# EAGLE design l6219-dev-lut (EAGLE 5.12)
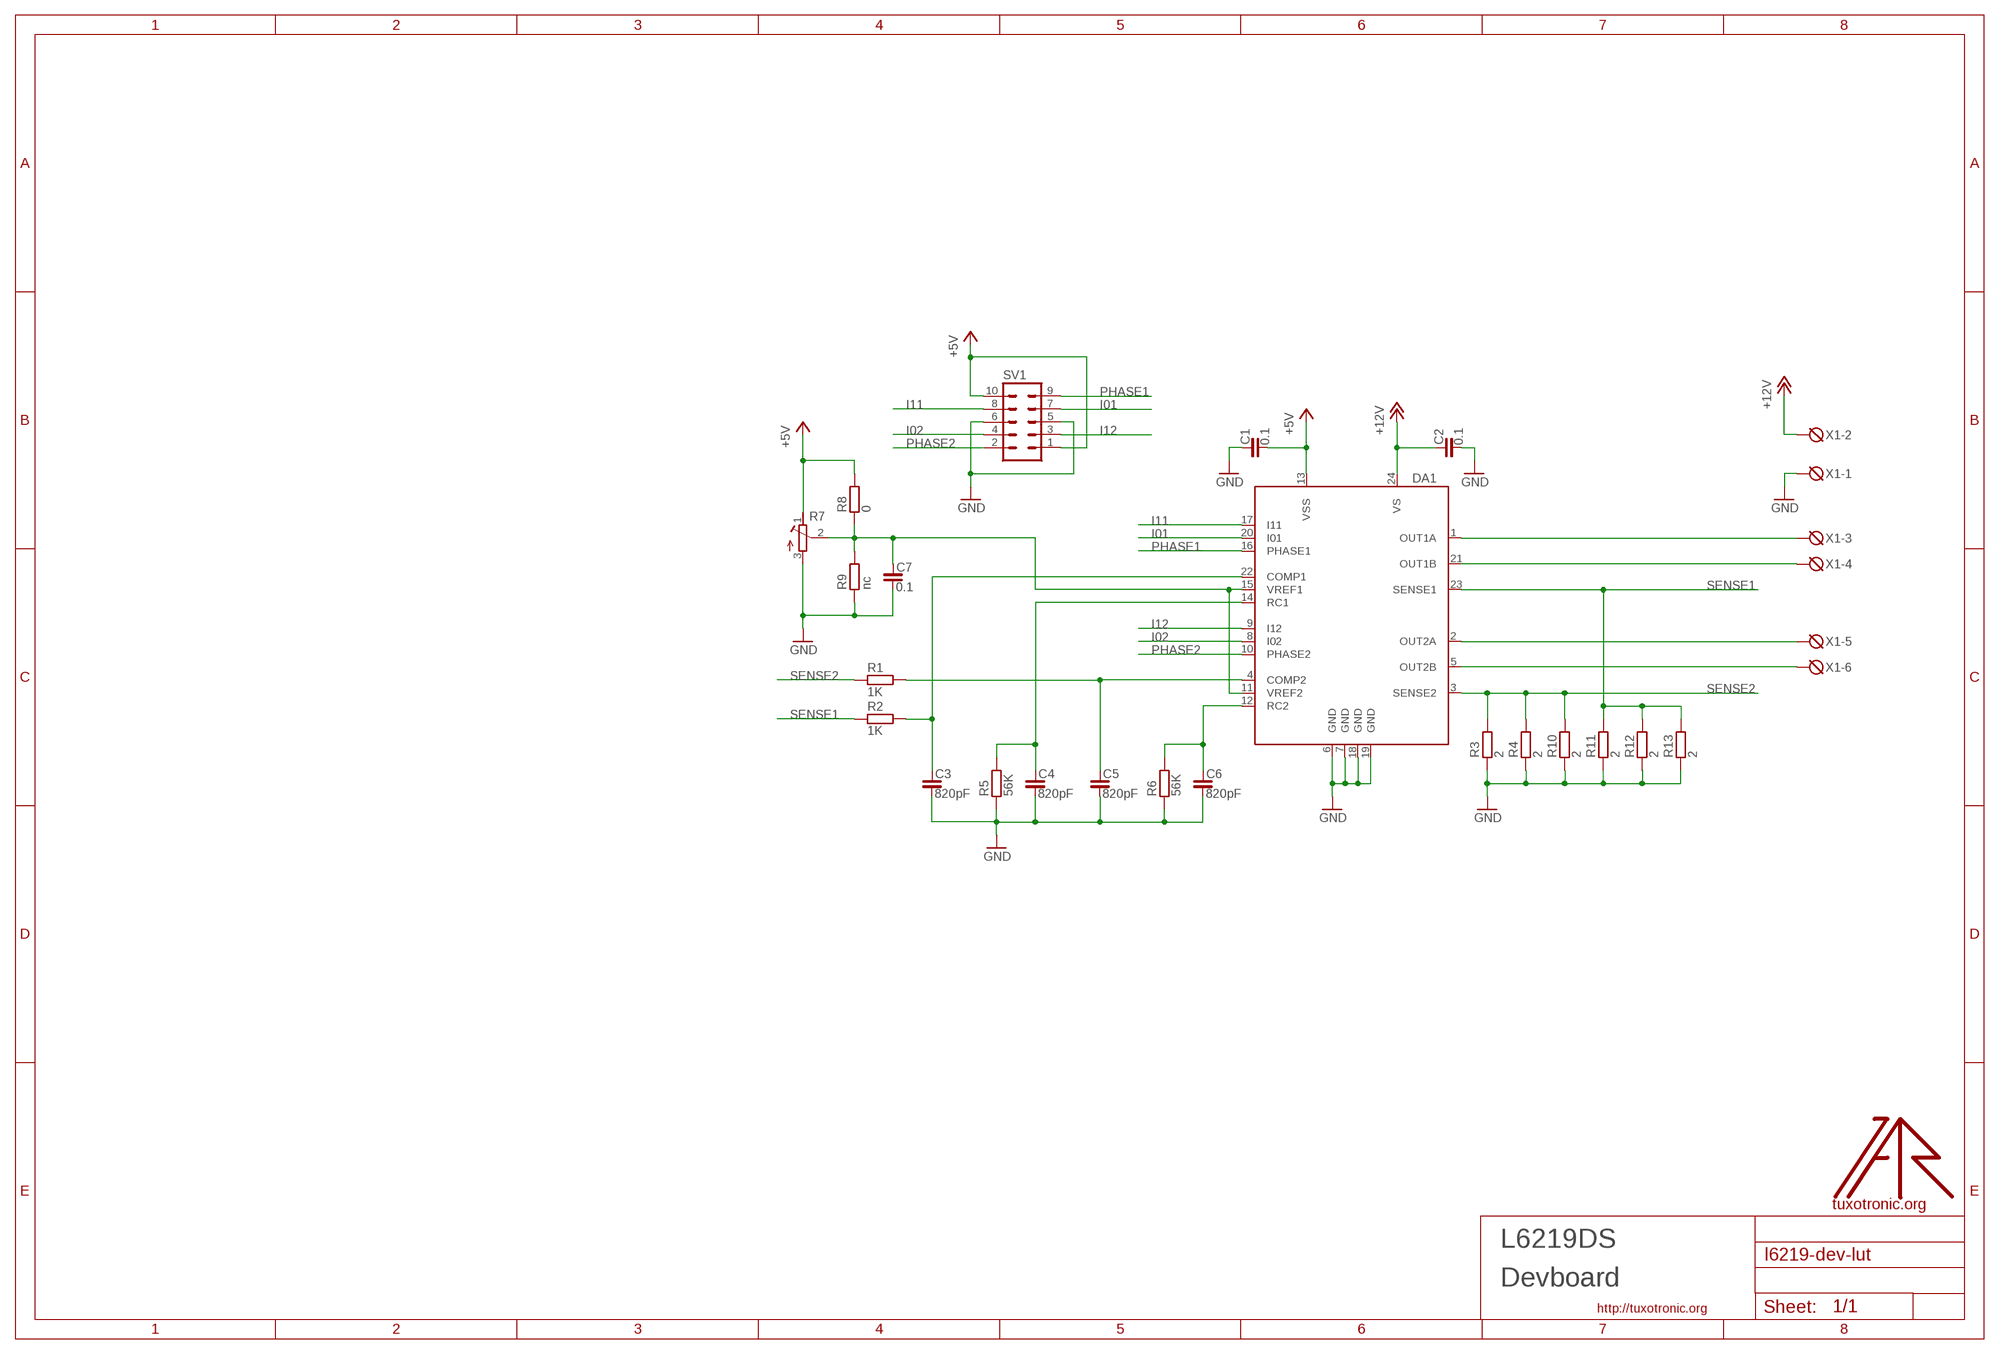
[diagram p0: schematic, sheet 1]

## Parts
C1  0.1  C_0805  [C0805]
C2  0.1  C_0805  [C0805]
C3  820pF  C_0805  [C0805]
C4  820pF  C_0805  [C0805]
C5  820pF  C_0805  [C0805]
C6  820pF  C_0805  [C0805]
C7  0.1  C_0805  [C0805]
DA1  L6219DS  [SO24W]
R1  1K  R_0805  [R0805]
R2  1K  R_0805  [R0805]
R3  2  R_1206  [R1206]
R4  2  R_1206  [R1206]
R5  56K  R_0805  [R0805]
R6  56K  R_0805  [R0805]
R7  RTRIM  [RTRIM-3362P]
R8  0  R_0805  [R0805]
R9  nc  R_0805  [R0805]
R10  2  R_1206  [R1206]
R11  2  R_1206  [R1206]
R12  2  R_1206  [R1206]
R13  2  R_1206  [R1206]
SV1  ML10  [ML10]
U$  LOGO  [TT_LOGO]
X1  DG3XX-06-5.0  [DG306-5.0-06P]

## Nets
+5V: C1.2 DA1.13(VSS) R7.1(A) R8.2 SV1.1 SV1.10
+12V: C2.1 DA1.24(VS) X1.2
GND: C1.1 C2.2 C3.2 C4.2 C5.2 C6.2 C7.2 DA1.6(GND) DA1.7(GND) DA1.18(GND) DA1.19(GND) R3.1 R4.1 R5.1 R6.1 R7.3(E) R9.1 R10.1 R11.1 R12.1 R13.1 SV1.5 SV1.6 X1.1
I01: DA1.20(I01) SV1.7
I02: DA1.8(I02) SV1.4
I11: DA1.17(I11) SV1.8
I12: DA1.9(I12) SV1.3
N$1: C6.1 DA1.12(RC2) R6.2
N$2: C4.1 DA1.14(RC1) R5.2
N$4: C5.1 DA1.4(COMP2) R1.2
N$5: C3.1 DA1.22(COMP1) R2.2
N$6: DA1.2(OUT2A) X1.5
N$7: DA1.5(OUT2B) X1.6
N$8: DA1.1(OUT1A) X1.3
N$9: DA1.21(OUT1B) X1.4
PHASE1: DA1.16(PHASE1) SV1.9
PHASE2: DA1.10(PHASE2) SV1.2
SENSE1: DA1.23(SENSE1) R2.1 R11.2 R12.2 R13.2
SENSE2: DA1.3(SENSE2) R1.1 R3.2 R4.2 R10.2
VREF: C7.1 DA1.11(VREF2) DA1.15(VREF1) R7.2(S) R8.1 R9.2

## Notes on the sheet
- L6219DS
- Devboard

## Library data of the parts
C1-C7 = rc-master-smd:C_: NON-POLARIZED CAP
DA1 = h-bridge:L6219: Stepper motor driver
R1-R6 R8-R13 = rc-master-smd:R_: RESISTOR
R7 = lcd-char:RTRIM
SV1 = con-ml:ML10: HARTING
U$ = logo:LOGO
X1 = degson:DG3XX-06: DG350-3.5-06P DG306-5.0-06P

## Board
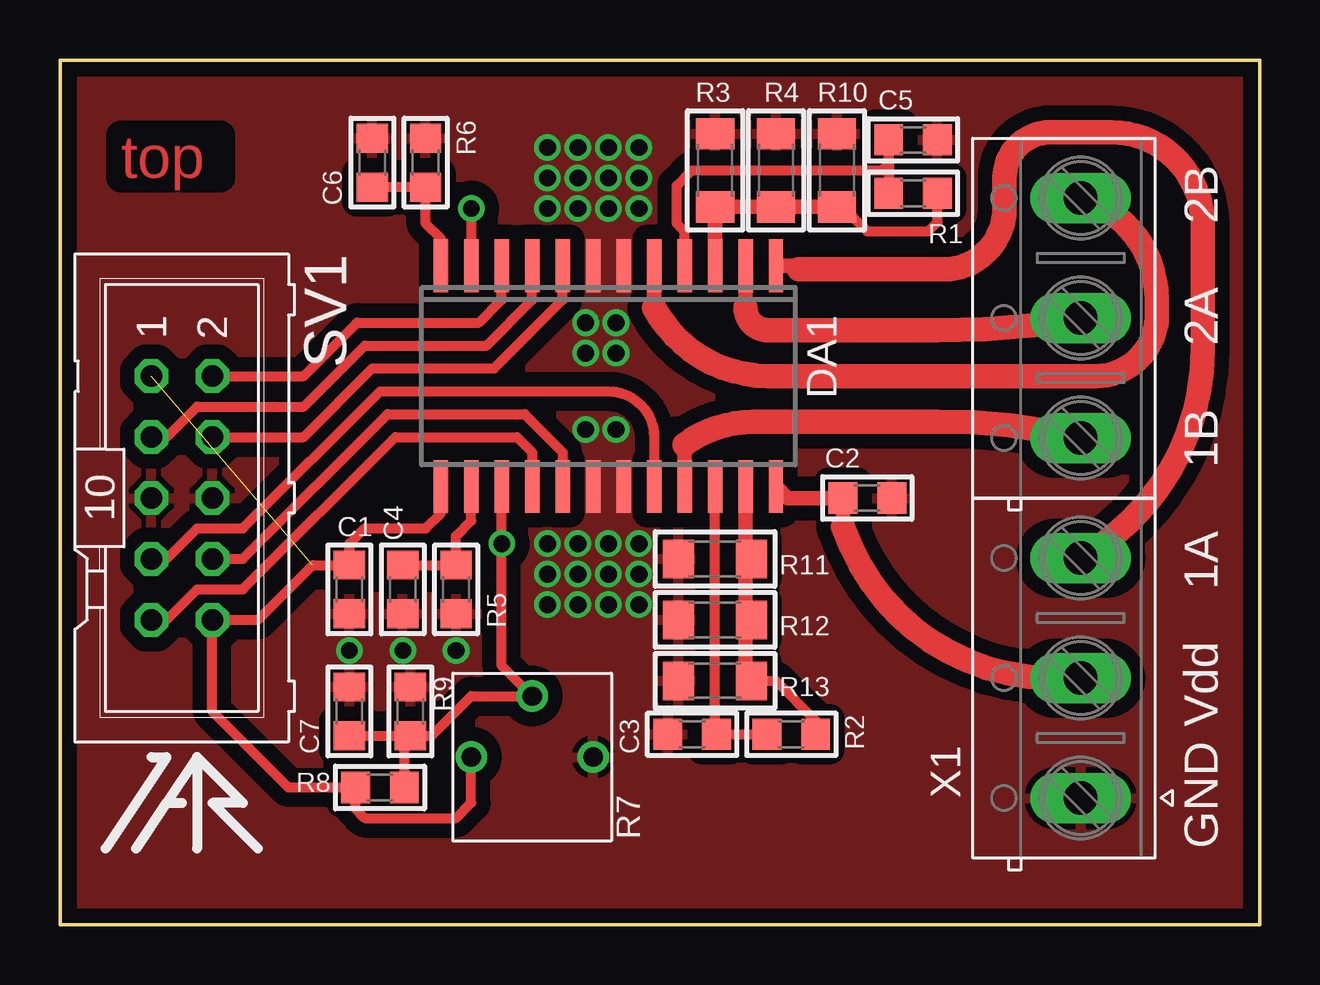
[diagram p1: board, top side]
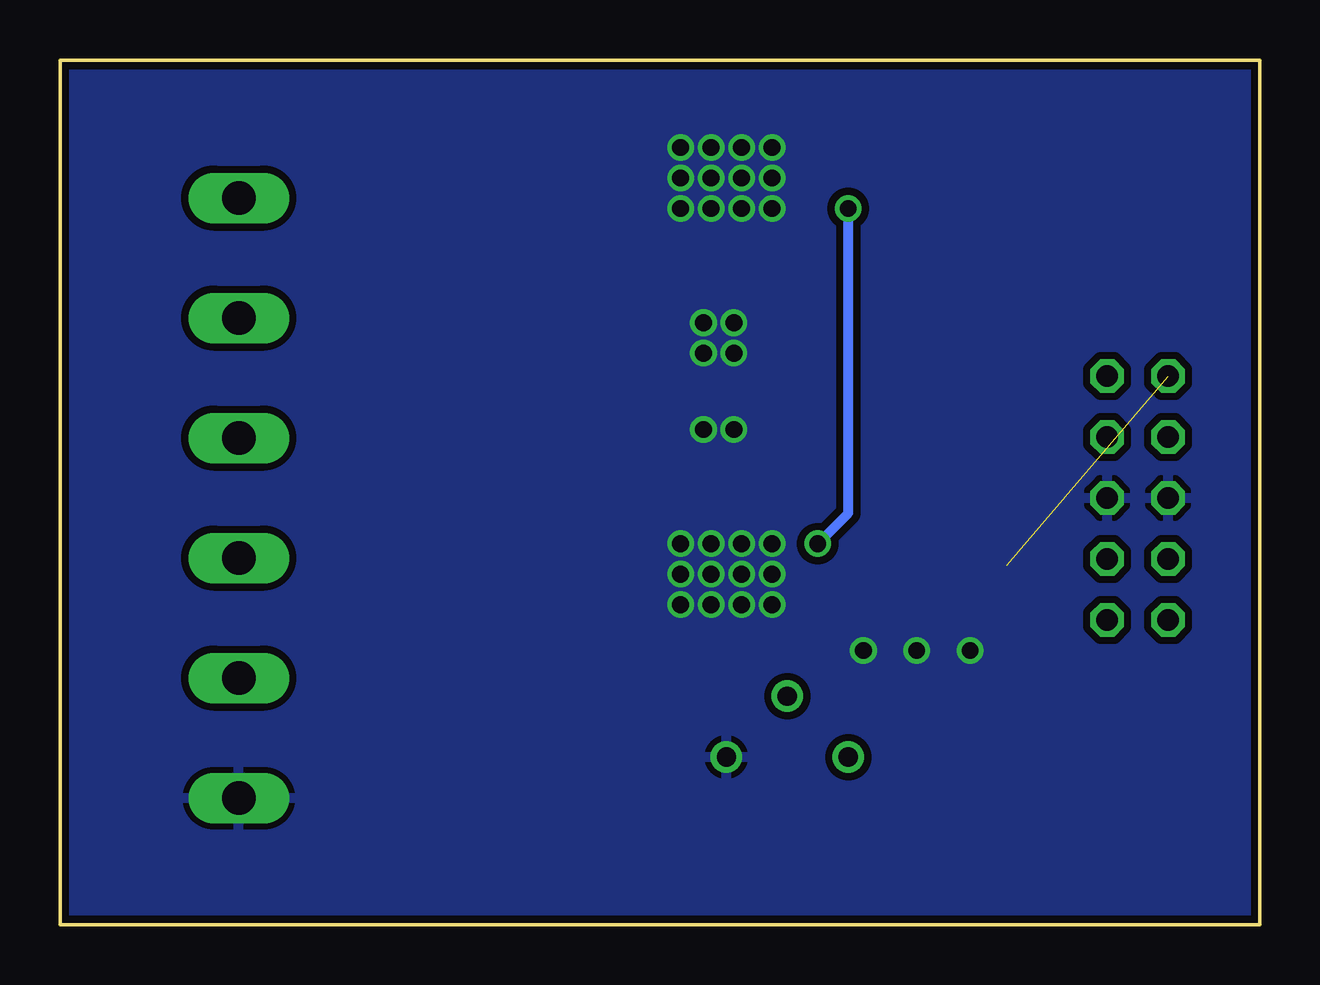
[diagram p2: board, bottom side, seen from below]

Size 50 x 36.03 mm. Coordinates in mm from the lower left corner, seen from the top.
Outline: 0,0 50,0 50,36.03 0,36.03 0,0
Copper layers (1*16): Top 0.035mm / dielectric 1.5mm / Bottom 0.035mm
Design rules "resonit-speed-18mkm_new": minimum track width 10mil, minimum drill 0.4mm, track to track 0.16mm, track to pad 0.16mm, pad to pad 0.16mm, via to via 0.16mm, smd to smd 0.16mm, copper to edge 0.3mm, drill to drill 8mil, minimum pad ring 10mil, minimum via ring 8mil, stop-mask expansion 4mil, vias tented up to drill 0.6mm, thermal gap 10mil

### Footprints (pad centres in the part's own frame; a part is rotated, then mirrored left to right if it is on the bottom)
C0805 = smd 1.2 x 1.3: 1 -1.016,0; 2 1.016,0
SO24W = smd 0.6 x 2.2: 1 -6.985,-4.6; 2 -5.715,-4.6; 3 -4.445,-4.6; 4 -3.175,-4.6; 5 -1.905,-4.6; 6 -0.635,-4.6; 7 0.635,-4.6; 8 1.905,-4.6; 9 3.175,-4.6; 10 4.445,-4.6; 11 5.715,-4.6; 12 6.985,-4.6; 13 6.985,4.6; 14 5.715,4.6; 15 4.445,4.6; 16 3.175,4.6; 17 1.905,4.6; 18 0.635,4.6; 19 -0.635,4.6; 20 -1.905,4.6; 21 -3.175,4.6; 22 -4.445,4.6; 23 -5.715,4.6; 24 -6.985,4.6
R0805 = smd 1.2 x 1.3: 1 -1.016,0; 2 1.016,0
R1206 = smd 1.3 x 1.6: 1 -1.524,0; 2 1.524,0
RTRIM-3362P = drill 0.8 round: 1 -2.54,0; 2 0,2.54; 3 2.54,0
ML10 = drill 0.9 octagon: 1 -5.08,-1.27; 2 -5.08,1.27; 3 -2.54,-1.27; 4 -2.54,1.27; 5 0,-1.27; 6 0,1.27; 7 2.54,-1.27; 8 2.54,1.27; 9 5.08,-1.27; 10 5.08,1.27
DG306-5.0-06P = drill 1.4 long: 1 -12.5,0; 2 -7.5,0; 3 -2.5,0; 4 2.5,0; 5 7.5,0; 6 12.5,0

### Placement (x,y rotation side)
C1  12.06,13.97 90 top
C2  33.66,17.78 0 top
C3  26.35,7.94 180 top
C4  14.29,13.97 270 top
C5  35.56,32.7 0 top
C6  13.02,31.75 90 top
C7  12.06,8.89 90 top
DA1  22.86,22.86 180 top
R1  35.56,30.48 180 top
R2  30.48,7.94 180 top
R3  27.3,31.43 270 top
R4  29.84,31.43 270 top
R5  16.51,13.97 90 top
R6  15.24,31.75 270 top
R7  19.68,6.99 0 top
R8  13.34,5.71 180 top
R9  14.61,8.89 270 top
R10  32.38,31.43 270 top
R11  27.3,15.24 0 top
R12  27.3,12.7 0 top
R13  27.3,10.16 0 top
SV1  5.08,17.78 270 top
U$  5.71,5.71 0 top
X1  42.55,17.78 90 top

### Tracks (layer width: path | path; a pad name or v marks a point on that pad's centre or on a via)
+5V  (1 unrouted)
  Top 0.406: DA1.13 15.88,17.14 15.24,16.51 12.7,16.51 12.06,15.88 C1.2 10.54,14.99 8.26,12.7 SV1.10 6.35,8.89 9.53,5.71 R8.2 12.32,4.83 12.7,4.45 16.51,4.45 17.14,5.08 R7.1
+12V
  Top 0.61: DA1.24 30.32,17.78 C2.1 32.64,16.57
  Top 1.016: X1.2 42.11,10.28 arc-75 32.64,16.57
GND  (via drill 0.7)
  other vias: 16.51,11.43 14.29,11.43 12.06,11.43 22.86,15.88 21.59,15.88 20.32,15.88 22.86,14.61 21.59,14.61 20.32,14.61 22.86,13.34 21.59,13.34 20.32,13.34 23.18,25.08 21.91,25.08 24.13,29.84 22.86,29.84 21.59,29.84 21.59,31.11 22.86,31.11 24.13,31.11 22.86,32.38 21.59,32.38 20.32,32.38 20.32,31.11 20.32,29.84 23.18,20.64 21.91,20.64 24.13,32.38 24.13,15.88 24.13,14.61 24.13,13.34 21.91,23.81 23.18,23.81
  pour Top (isolate 0.61, rank 5): -0.64,36.83 50.8,36.83 50.8,-0.64 -0.64,-0.64
  pour Bottom (isolate 0.305, rank 5): -1.27,37.47 51.44,37.47 51.44,-1.27 -1.27,-1.27
I01
  Top 0.406: SV1.7 4.45,15.24 5.71,16.51 7.62,16.51 13.34,22.23 22.86,22.23 arc-90 24.77,20.32 DA1.20
I02
  Top 0.406: SV1.4 10.16,20.32 13.02,23.18 18.1,23.18 20.95,26.04 DA1.8
I11
  Top 0.406: SV1.8 7.62,15.24 13.65,21.27 19.37,21.27 20.95,19.68 DA1.17
I12
  Top 0.406: SV1.3 4.45,20.32 5.71,21.59 10.16,21.59 12.7,24.13 17.78,24.13 19.68,26.04 DA1.9
N$1
  Top 0.406: C6.1 R6.2 15.24,29.21 15.88,28.57 DA1.12
N$2
  Top 0.406: C4.1 R5.2 16.51,16.19 17.14,16.83 DA1.14
N$4
  Top 0.406: 34.54,31.69 R1.2 | 34.54,31.69 34.29,31.43 26.35,31.43 25.72,30.8 25.72,29.21 26.04,28.89 DA1.4 | 34.54,31.69 C5.1
N$5
  Top 0.406: C3.1 27.3,8 | C3.1 27.62,7.94 | 27.62,7.94 R2.2 | DA1.22 27.3,8.26 27.62,7.94 | 27.62,7.94 27.62,8.19 C3.1
N$6
  Top 0.61: 28.57,25.72 DA1.2
  Top 1.016: 28.57,25.72 arc90 29.53,24.77 36.55,24.77 arc11 X1.5
N$7
  Top 0.61: DA1.5 24.77,25.72
  Top 1.016: 24.77,25.72 arc62 29.53,22.86 43.18,22.86 arc90 45.72,25.4 45.72,26.04 arc74 X1.6
N$8
  Top 0.61: DA1.1 30.64,27.46 30.8,27.3
  Top 1.016: 30.8,27.3 36.83,27.3 arc90 39.37,29.84 39.37,31.11 arc-90 41.27,33.02 43.81,33.02 arc-90 47.62,29.21 47.62,23.93 arc-61 X1.3
N$9
  Top 0.61: DA1.21 26.04,20
  Top 1.016: 26.04,20 arc-37 28.89,20.95 36.55,20.95 arc-14 X1.4
PHASE1
  Top 0.406: DA1.16 19.68,19.68 19.05,20.32 13.97,20.32 7.62,13.97 5.71,13.97 4.45,12.7 SV1.9
PHASE2
  Top 0.406: SV1.2 10.16,22.86 12.38,25.08 17.46,25.08 18.41,26.04 DA1.10
SENSE1
  Top 0.406: R2.1 31.5,8.51 29.84,10.16 R13.2 28.51,10.16 28.57,10.22 | 28.57,12.7 R12.2 | 28.57,15.24 R11.2
  Top 0.61: 28.57,10.22 28.57,12.7 28.57,15.24 DA1.23
SENSE2
  Top 0.406: R1.1 36.58,29.27 36.2,28.89 33.66,28.89 33.02,29.53 R10.2
  Top 0.61: R10.2 R4.2 R3.2 DA1.3
VREF  (via drill 0.7)
  Top 0.406: C7.1 R9.2 | R8.1 14.35,7.62 R9.2 | R9.2 15.49,7.87 17.14,9.53 R7.2 18.41,10.79 v18.41,15.88 DA1.15 | v17.14,29.84 DA1.11
  Bottom 0.406: v17.14,29.84 17.14,17.14 v18.41,15.88

### Text on the board
Top: top
tPlace: 2B | 2A | 1B | 1A | Vdd | GND